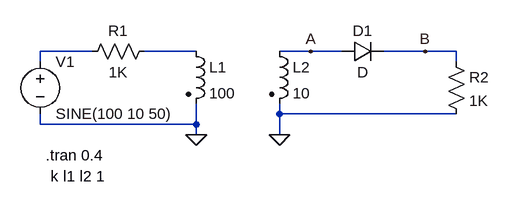
[diagram p0: schematic Half-wave Rectifier.asc]
Half-wave Rectifier.asc, the LTspice schematic file:
Version 4
SHEET 1 880 680
WIRE -48 96 -128 96
WIRE 112 96 32 96
WIRE 288 96 240 96
WIRE 336 96 288 96
WIRE 464 96 400 96
WIRE 512 96 464 96
WIRE -128 112 -128 96
WIRE 512 112 512 96
WIRE 240 192 240 176
WIRE 512 192 240 192
WIRE -128 208 -128 192
WIRE 112 208 112 176
WIRE 112 208 -128 208
WIRE 112 224 112 208
WIRE 240 224 240 192
FLAG 240 224 0
FLAG 112 224 0
FLAG 288 96 A
FLAG 464 96 B
SYMBOL ind2 96 80 R0
SYMATTR InstName L1
SYMATTR Value 100
SYMATTR Type ind
SYMBOL ind2 224 80 R0
SYMATTR InstName L2
SYMATTR Value 10
SYMATTR Type ind
SYMBOL res 48 80 R90
WINDOW 0 0 56 VBottom 2
WINDOW 3 32 56 VTop 2
SYMATTR InstName R1
SYMATTR Value 1K
SYMBOL voltage -128 96 R0
WINDOW 123 0 0 Left 0
WINDOW 39 0 0 Left 0
SYMATTR InstName V1
SYMATTR Value SINE(100 10 50)
SYMBOL diode 336 112 R270
WINDOW 0 32 32 VTop 2
WINDOW 3 0 32 VBottom 2
SYMATTR InstName D1
SYMBOL res 496 96 R0
SYMATTR InstName R2
SYMATTR Value 1K
TEXT -120 256 Left 2 !.tran 0.4
TEXT -112 288 Left 2 !k l1 l2 1

The netlist it stands for:
* Half-wave Rectifier.asc
L1 N002 0 100
L2 A 0 10
R1 N002 N001 1K
V1 N001 0 SINE(100 10 50)
D1 A B D
R2 B 0 1K
.model D D
.lib standard.dio
.tran 0.4
k l1 l2 1
.backanno
.end